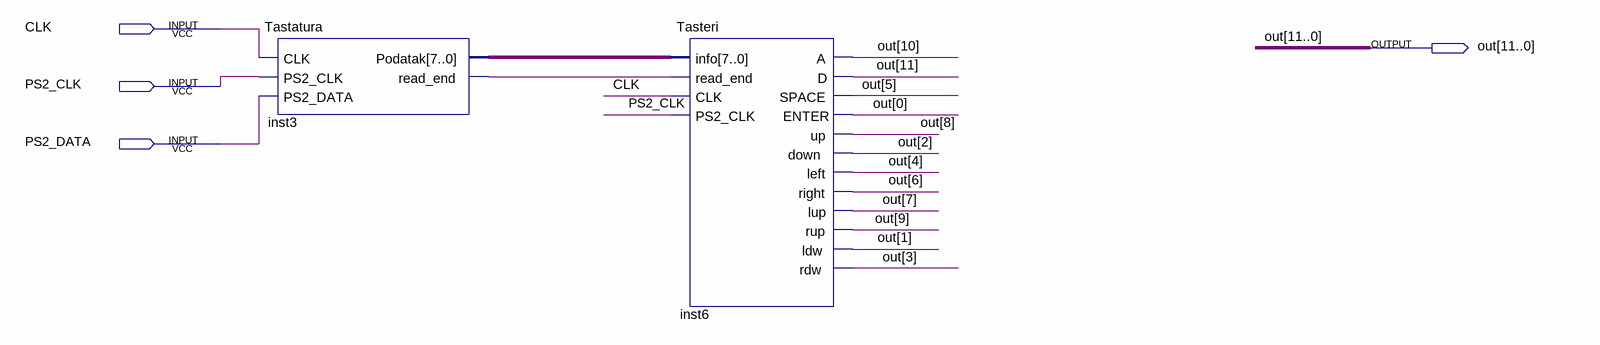
[diagram p0: schematic sheet]
// Quartus schematic Igrica_projekat.bdf as structural Verilog: 2 symbols, 4 pins
module Igrica_projekat (
  input  CLK,
  input  PS2_CLK,
  input  PS2_DATA,
  output [11:0] out
);

  wire inst3_read_end;
  wire [7:0] inst3_podatak;

  Tastatura inst3 (
    .CLK(CLK), .PS2_CLK(PS2_CLK), .PS2_DATA(PS2_DATA), .Podatak(inst3_podatak), .read_end(inst3_read_end));
  Tasteri inst6 (
    .info(inst3_podatak), .read_end(inst3_read_end), .CLK(CLK), .PS2_CLK(PS2_CLK), .A(out[10]), .D(out[11]),
    .SPACE(out[5]), .ENTER(out[0]), .up(out[8]), .down(out[2]), .left(out[4]), .right(out[6]), .lup(out[7]),
    .rup(out[9]), .ldw(out[1]), .rdw(out[3]));
endmodule
